# Altium schematic sheet Debugging Interface.SchDoc: Debugging Interface
size A3; DocumentNumber: 4; SheetNumber: 4; SheetTotal: 6
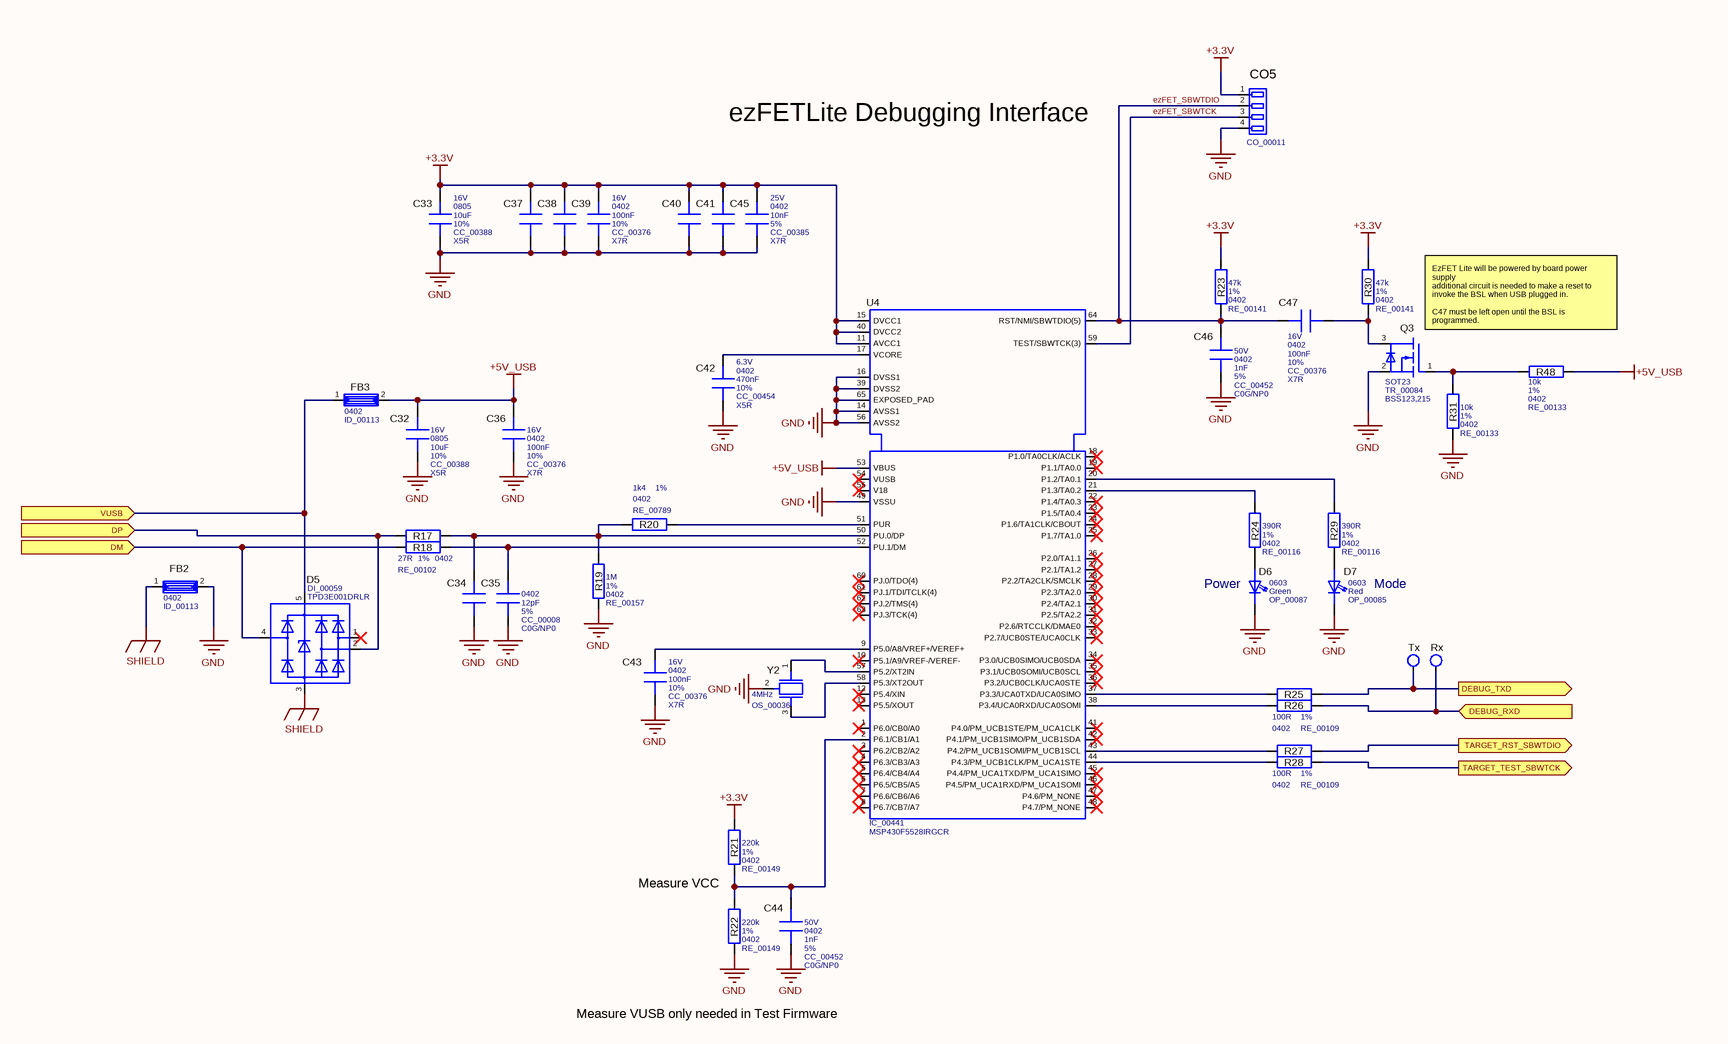
[diagram p0: Debugging Interface.SchDoc]

## Parts
C32  Voltage: 16V  Package: 0805  Capacitance: 10uF  Tolerance: 10%  Part_Number: CC_00388  Dielectric_Material: X5R  [CS2000x1250x1250x350x1650L]  (hidden comment: capacitor)
C33  Voltage: 16V  Package: 0805  Capacitance: 10uF  Tolerance: 10%  Part_Number: CC_00388  Dielectric_Material: X5R  [CS2000x1250x1250x350x1650L]  (hidden comment: capacitor)
C34  capacitor  [CS1000X500X560X250X820L]  (value not drawn)
C35  Package: 0402  Capacitance: 12pF  Tolerance: 5%  Part_Number: CC_00008  Dielectric_Material: C0G/NP0  [CS1000X500X560X250X820L]  (hidden comment: capacitor)
C36  Voltage: 16V  Package: 0402  Capacitance: 100nF  Tolerance: 10%  Part_Number: CC_00376  Dielectric_Material: X7R  [CS1000X500X560X250X820L]  (hidden comment: capacitor)
C37  capacitor  [CS1000X500X560X250X820L]  (value not drawn)
C38  capacitor  [CS1000X500X560X250X820L]  (value not drawn)
C39  Voltage: 16V  Package: 0402  Capacitance: 100nF  Tolerance: 10%  Part_Number: CC_00376  Dielectric_Material: X7R  [CS1000X500X560X250X820L]  (hidden comment: capacitor)
C40  capacitor  [CS1000X500X560X250X820L]  (value not drawn)
C41  capacitor  [CS1000X500X560X250X820L]  (value not drawn)
C42  Voltage: 6.3V  Package: 0402  Capacitance: 470nF  Tolerance: 10%  Part_Number: CC_00454  Dielectric_Material: X5R  [CS1000X500X560X250X820L]  (hidden comment: capacitor)
C43  Voltage: 16V  Package: 0402  Capacitance: 100nF  Tolerance: 10%  Part_Number: CC_00376  Dielectric_Material: X7R  [CS1000X500X560X250X820L]  (hidden comment: capacitor)
C44  Voltage: 50V  Package: 0402  Capacitance: 1nF  Tolerance: 5%  Part_Number: CC_00452  Dielectric_Material: C0G/NP0  [CS1000X500X560X250X820L]  (hidden comment: capacitor)
C45  Voltage: 25V  Package: 0402  Capacitance: 10nF  Tolerance: 5%  Part_Number: CC_00385  Dielectric_Material: X7R  [CS1000X500X560X250X820L]  (hidden comment: capacitor)
C46  Voltage: 50V  Package: 0402  Capacitance: 1nF  Tolerance: 5%  Part_Number: CC_00452  Dielectric_Material: C0G/NP0  [CS1000X500X560X250X820L]  (hidden comment: capacitor)
C47  Voltage: 16V  Package: 0402  Capacitance: 100nF  Tolerance: 10%  Part_Number: CC_00376  Dielectric_Material: X7R  [CS1000X500X560X250X820L]  (hidden comment: capacitor)
CO5  CO_00011  [CO_00011N]
D5  Manufacturer_Number: TPD3E001DRLR  [DI_00059N]  (hidden comment: DI_00059)
D6  Package: 0603  Color: Green  Part_Number: OP_00087  [OP_00087L]  (hidden comment: LED)
D7  Package: 0603  Color: Red  Part_Number: OP_00085  [OP_00085L]  (hidden comment: LED)
FB2  Package: 0402  Part_Number: ID_00113  [IS1000x500x500x200x800L]  (hidden comment: ferrit)
FB3  Package: 0402  Part_Number: ID_00113  [IS1000x500x500x200x800L]  (hidden comment: ferrit)
Q3  Package: SOT23  Part_Number: TR_00084  Manufacturer_Number: BSS123,215  [TR_00084N]  (hidden comment: nmosfet)
R17  Resistor  [RS1000X500X560X250X820L]  (value not drawn)
R18  Resistance: 27R  Tolerance: 1%  Package: 0402  Part_Number: RE_00102  [RS1000X500X560X250X820L]  (hidden comment: Resistor)
R19  Resistance: 1M  Tolerance: 1%  Package: 0402  Part_Number: RE_00157  [RS1000X500X560X250X820L]  (hidden comment: Resistor)
R20  Resistance: 1k4  Tolerance: 1%  Package: 0402  Part_Number: RE_00789  [RS1000X500X560X250X820L]  (hidden comment: Resistor)
R21  Resistance: 220k  Tolerance: 1%  Package: 0402  Part_Number: RE_00149  [RS1000X500X560X250X820L]  (hidden comment: Resistor)
R22  Resistance: 220k  Tolerance: 1%  Package: 0402  Part_Number: RE_00149  [RS1000X500X560X250X820L]  (hidden comment: Resistor)
R23  Resistance: 47k  Tolerance: 1%  Package: 0402  Part_Number: RE_00141  [RS1000X500X560X250X820L]  (hidden comment: Resistor)
R24  Resistance: 390R  Tolerance: 1%  Package: 0402  Part_Number: RE_00116  [RS1000X500X560X250X820L]  (hidden comment: Resistor)
R25  Resistor  [RS1000X500X560X250X820L]  (value not drawn)
R26  Resistance: 100R  Tolerance: 1%  Package: 0402  Part_Number: RE_00109  [RS1000X500X560X250X820L]  (hidden comment: Resistor)
R27  Resistor  [RS1000X500X560X250X820L]  (value not drawn)
R28  Resistance: 100R  Tolerance: 1%  Package: 0402  Part_Number: RE_00109  [RS1000X500X560X250X820L]  (hidden comment: Resistor)
R29  Resistance: 390R  Tolerance: 1%  Package: 0402  Part_Number: RE_00116  [RS1000X500X560X250X820L]  (hidden comment: Resistor)
R30  Resistance: 47k  Tolerance: 1%  Package: 0402  Part_Number: RE_00141  [RS1000X500X560X250X820L]  (hidden comment: Resistor)
R31  Resistance: 10k  Tolerance: 1%  Package: 0402  Part_Number: RE_00133  [RS1000X500X560X250X820L]  (hidden comment: Resistor)
R48  Resistance: 10k  Tolerance: 1%  Package: 0402  Part_Number: RE_00133  [RS1000X500X560X250X820L]  (hidden comment: Resistor)
Rx  testpoint  [CO_00057N]  (value not drawn)  (no BOM)
Tx  testpoint  [CO_00057N]  (value not drawn)  (no BOM)
U4  Manufacturer_Number: MSP430F5528IRGCR  [IC_00441N]  (hidden comment: IC_00441)
Y2  Part_Number: OS_00036  Nominal_frequency: 4MHz  [OS_00036N]  (hidden comment: ceramic_resonator)

## Ports
DEBUG_RXD (in), DEBUG_TXD (out), DM (in), DP (in), TARGET_RST_SBWTDIO (out), TARGET_TEST_SBWTCK (out), VUSB (in)

## Nets
+3.3V: C33.2(PIN2) C37.2(PIN2) C38.2(PIN2) C39.2(PIN2) C40.2(PIN2) C41.2(PIN2) C45.2(PIN2) CO5.1(PIN1) R21.2(PIN2) R23.2(PIN2) R30.2(PIN2) U4.11(AVCC1) U4.15(DVCC1) U4.40(DVCC2)
+5V_USB: C32.2(PIN2) C36.2(PIN2) FB3.2(PIN2) R48.1(PIN1) U4.53(VBUS)
GND: C32.1(PIN1) C33.1(PIN1) C34.1(PIN1) C35.1(PIN1) C36.1(PIN1) C37.1(PIN1) C38.1(PIN1) C39.1(PIN1) C40.1(PIN1) C41.1(PIN1) C42.1(PIN1) C43.1(PIN1) C44.1(PIN1) C45.1(PIN1) C46.1(PIN1) CO5.4(PIN4) D6.1(CATHODE) D7.1(CATHODE) FB2.2(PIN2) Q3.2(S) R19.1(PIN1) R22.1(PIN1) R31.1(PIN1) U4.14(AVSS1) U4.16(DVSS1) U4.39(DVSS2) U4.49(VSSU) U4.56(AVSS2) U4.65(EXPOSED_PAD) Y2.2(PIN2)
SHIELD: D5.3(GND) FB2.1(PIN1)
DEBUG_RXD: R26.2(PIN2) Rx.1(PIN1) ; port DEBUG_RXD
DEBUG_TXD: R25.2(PIN2) Tx.1(PIN1) ; port DEBUG_TXD
DM: D5.4(IO3) R18.1(PIN1) ; port DM
DP: D5.2(IO2) R17.1(PIN1) ; port DP
ezFET_SBWTCK: CO5.3(PIN3) U4.59(TEST/SBWTCK(3))
ezFET_SBWTDIO: C46.2(PIN2) C47.2(PIN2) CO5.2(PIN2) R23.1(PIN1) U4.64(RST/NMI/SBWTDIO(5))
TARGET_RST_SBWTDIO: R27.2(PIN2) ; port TARGET_RST_SBWTDIO
TARGET_TEST_SBWTCK: R28.2(PIN2) ; port TARGET_TEST_SBWTCK
VUSB: D5.5(VCC) FB3.1(PIN1) ; port VUSB
NetC34_2: C34.2(PIN2) R17.2(PIN2) R19.2(PIN2) R20.1(PIN1) U4.50(PU.0/DP)
NetC35_2: C35.2(PIN2) R18.2(PIN2) U4.52(PU.1/DM)
NetC42_2: C42.2(PIN2) U4.17(VCORE)
NetC43_2: C43.2(PIN2) U4.9(P5.0/A8/VREF+/VEREF+)
NetC44_2: C44.2(PIN2) R21.1(PIN1) R22.2(PIN2) U4.2(P6.1/CB1/A1)
NetC47_1: C47.1(PIN1) Q3.3(D) R30.1(PIN1)
NetD6_2: D6.2(ANODE) R24.1(PIN1)
NetD7_2: D7.2(ANODE) R29.1(PIN1)
NetQ3_1: Q3.1(G) R31.2(PIN2) R48.2(PIN2)
NetR20_2: R20.2(PIN2) U4.51(PUR)
NetR24_2: R24.2(PIN2) U4.21(P1.3/TA0.2)
NetR25_1: R25.1(PIN1) U4.37(P3.3/UCA0TXD/UCA0SIMO)
NetR26_1: R26.1(PIN1) U4.38(P3.4/UCA0RXD/UCA0SOMI)
NetR27_1: R27.1(PIN1) U4.43(P4.2/PM_UCB1SOMI/PM_UCB1SCL)
NetR28_1: R28.1(PIN1) U4.44(P4.3/PM_UCB1CLK/PM_UCA1STE)
NetR29_2: R29.2(PIN2) U4.20(P1.2/TA0.1)
NetU4_57: U4.57(P5.2/XT2IN) Y2.1(PIN1)
NetU4_58: U4.58(P5.3/XT2OUT) Y2.3(PIN3)

Not connected (* = marked no-connect by the designer): D5 1(IO1)*; U4 1(P6.0/CB0/A0)* 3(P6.2/CB2/A2)* 4(P6.3/CB3/A3)* 5(P6.4/CB4/A4)* 6(P6.5/CB5/A5)* 7(P6.6/CB6/A6)* 8(P6.7/CB7/A7)* 10(P5.1/A9/VREF-/VEREF-)* 12(P5.4/XIN)* 13(P5.5/XOUT)* 18(P1.0/TA0CLK/ACLK)* 19(P1.1/TA0.0)* 22(P1.4/TA0.3)* 23(P1.5/TA0.4)* 24(P1.6/TA1CLK/CBOUT)* 25(P1.7/TA1.0)* 26(P2.0/TA1.1)* 27(P2.1/TA1.2)* 28(P2.2/TA2CLK/SMCLK)* 29(P2.3/TA2.0)* 30(P2.4/TA2.1)* 31(P2.5/TA2.2)* 32(P2.6/RTCCLK/DMAE0)* 33(P2.7/UCB0STE/UCA0CLK)* 34(P3.0/UCB0SIMO/UCB0SDA)* 35(P3.1/UCB0SOMI/UCB0SCL)* 36(P3.2/UCB0CLK/UCA0STE)* 41(P4.0/PM_UCB1STE/PM_UCA1CLK)* 42(P4.1/PM_UCB1SIMO/PM_UCB1SDA)* 45(P4.4/PM_UCA1TXD/PM_UCA1SIMO)* 46(P4.5/PM_UCA1RXD/PM_UCA1SOMI)* 47(P4.6/PM_NONE)* 48(P4.7/PM_NONE)* 54(VUSB)* 55(V18)* 60(PJ.0/TDO(4))* 61(PJ.1/TDI/TCLK(4))* 62(PJ.2/TMS(4))* 63(PJ.3/TCK(4))*

## Notes on the sheet
- ezFETLite Debugging Interface
- (near Q3) EzFET Lite will be powered by board power supply
  additional circuit is needed to make a reset to
  invoke the BSL when USB plugged in.
  C47 must be left open until the BSL is programmed.
- (near D6) Power
- Mode
- Measure VCC
- Measure VUSB only needed in Test Firmware
- Size
- A3
- Rev
- Sheet
- of
- Date changed
- FH  JOANNEUM
- University of Applied Sciences
- Drawn by
- Title
- Check by

## Library data of the parts
C32 C33 = CC_00388: Part_Type: Fixed capacitors; Manufacturer_Number: GRM21BR61C106KE15L; Maximum_Capacitance: 0; Creator: Krenn Markus; Minimum_Capacitance: 0; Nominal_Voltage: 0; Creation_Date: 09.07.2012; Datasheet_Link: http://ibi/dxdb_partdatasheet_download.php?pid=388
C34 = CC_00008: Part_Type: Fixed capacitors; Manufacturer_Number: GRM1555C1H120JA01D; Voltage: 50V; Capacitance: 12pF; Tolerance: 5%; Dielectric_Material: C0G/NP0; Maximum_Capacitance: 0; Package: 0402; Creator: Krenn Markus; Part_Number: CC_00008; Minimum_Capacitance: 0; Nominal_Voltage: 0; Creation_Date: 09.07.2012; Datasheet_Link: http://ibi/dxdb_partdatasheet_download.php?pid=8
C35 = CC_00008: Part_Type: Fixed capacitors; Manufacturer_Number: GRM1555C1H120JA01D; Voltage: 50V; Maximum_Capacitance: 0; Creator: Krenn Markus; Minimum_Capacitance: 0; Nominal_Voltage: 0; Creation_Date: 09.07.2012; Datasheet_Link: http://ibi/dxdb_partdatasheet_download.php?pid=8
C36 C39 C43 C47 = CC_00376: Part_Type: Fixed capacitors; Manufacturer_Number: GRM155R71C104KA88D; Maximum_Capacitance: 0; Creator: Okorn Robert; Minimum_Capacitance: 0; Nominal_Voltage: 0; Creation_Date: 09.07.2012; Datasheet_Link: http://ibi/dxdb_partdatasheet_download.php?pid=376
C37 C38 = CC_00376: Part_Type: Fixed capacitors; Manufacturer_Number: GRM155R71C104KA88D; Voltage: 16V; Capacitance: 100nF; Tolerance: 10%; Dielectric_Material: X7R; Maximum_Capacitance: 0; Package: 0402; Creator: Okorn Robert; Part_Number: CC_00376; Minimum_Capacitance: 0; Nominal_Voltage: 0; Creation_Date: 09.07.2012; Datasheet_Link: http://ibi/dxdb_partdatasheet_download.php?pid=376
C40 C41 = CC_00385: Part_Type: Fixed capacitors; Manufacturer_Number: C0402C103J3RACTU; Voltage: 25V; Capacitance: 10nF; Tolerance: 5%; Dielectric_Material: X7R; Maximum_Capacitance: 0; Package: 0402; Creator: Neissl Gernot; Part_Number: CC_00385; Minimum_Capacitance: 0; Nominal_Voltage: 0; Creation_Date: 09.07.2012; Datasheet_Link: http://ibi/dxdb_partdatasheet_download.php?pid=385
C42 = CC_00454: Part_Type: Fixed capacitors; Manufacturer_Number: 04026D474KAT2A; Maximum_Capacitance: 0; Creator: Krenn Markus; Minimum_Capacitance: 0; Nominal_Voltage: 0; Creation_Date: 04.01.2013; Datasheet_Link: http://ibi/dxdb_partdatasheet_download.php?pid=2152
C44 C46 = CC_00452: Part_Type: Fixed capacitors; Manufacturer_Number: C1005C0G1H102J050BA; Maximum_Capacitance: 0; Creator: Krenn Markus; Minimum_Capacitance: 0; Nominal_Voltage: 0; Creation_Date: 04.01.2013; Datasheet_Link: http://ibi/dxdb_partdatasheet_download.php?pid=2150
C45 = CC_00385: Part_Type: Fixed capacitors; Manufacturer_Number: C0402C103J3RACTU; Maximum_Capacitance: 0; Creator: Neissl Gernot; Minimum_Capacitance: 0; Nominal_Voltage: 0; Creation_Date: 09.07.2012; Datasheet_Link: http://ibi/dxdb_partdatasheet_download.php?pid=385
CO5 = CO_00011: PinHeader4x1 RM2.54mm Molex; Manufacturer_Number: 90120-0124; Current: 3A; Impedance: 0R; Power: 0W; Connector_Type: Pin-Header; Function_type: Wire-to-Board; Connector_gender: male; Pitch_style: 0.00254m; Mounting_angle: 0°; Contact_Count: 4; Row_Count: 1; Contact_coating: Gold; Nominal_AC_Voltage: 350VAC; Nominal_DC_Voltage: 350VDC; Mounting: Through Hole; Material: Brass; Creator: Krenn Markus; Part_Number: CO_00011; Creation_Date: 09.07.2012; Datasheet_Link: http://ibi/dxdb_partdatasheet_download.php?pid=439
D5 = DI_00059: 3-CHANNEL ESD-PROTECTION DIODE ARRAY; Power: 0W; Diode_type: ESD Surpressor Diode; Reverse_Voltage: 5.5V; Current_DC: 0A; Diodes_per_package: 3; Forward_Voltage: 0V; Reverse-recovery_time: 0s; Package: 5SOT; Creator: Krenn Markus; Part_Number: DI_00059; Creation_Date: 09.07.2012; Datasheet_Link: http://ibi/dxdb_partdatasheet_download.php?pid=824
D6 = OP_00087: Manufacturer_Number: TLMG1100-GS08; Type: Standard; Isolating_voltage: 0; Creator: Krenn Markus; Part_Type: LED; Transistor_type: 0; Creation_Date: 23.05.2016; Datasheet_Link: http://ibi/dxdb_partdatasheet_download.php?pid=3140
D7 = OP_00085: Manufacturer_Number: TLMS1100-GS08; Type: Standard; Isolating_voltage: 0; Creator: Krenn Markus; Part_Type: LED; Transistor_type: 0; Creation_Date: 23.05.2016; Datasheet_Link: http://ibi/dxdb_partdatasheet_download.php?pid=3138
FB2 FB3 = ID_00113: Manufacturer_Number: 7427927121; Part_Type: Inductors; Inductance: 0H; Current_DC: 200mA; Creator: Kohl Martin; Creation_Date: 20.05.2014; Datasheet_Link: http://ibi/dxdb_partdatasheet_download.php?pid=2601
Q3 = TR_00084: Part_Type: MOSFET; Current: 0; Drain-Source_DC_current: 150mA; Drain-Source_Voltage: 100V; Creator: Weis Gerald; Collector-Emitter_voltage: 0; Reverse_voltage: 0; RMS_Current: 0; Creation_Date: 07.04.2016; Datasheet_Link: http://ibi/dxdb_partdatasheet_download.php?pid=3103
R17 = RE_00102: Manufacturer_Number: CRCW040227R0FKED; Part_Type: Fixed Resistors; Resistance: 27R; Tolerance: 1%; Maximum_Resistance: 0; Nominal_voltage: 50V; Package: 0402; Type: 0; Creator: Krenn Markus; Part_Number: RE_00102; Nominal_DC_Voltage: 0; Impact_current: 0; Creation_Date: 09.07.2012; Datasheet_Link: http://ibi/dxdb_partdatasheet_download.php?pid=1507
R18 = RE_00102: Manufacturer_Number: CRCW040227R0FKED; Part_Type: Fixed Resistors; Maximum_Resistance: 0; Nominal_voltage: 50V; Type: 0; Creator: Krenn Markus; Nominal_DC_Voltage: 0; Impact_current: 0; Creation_Date: 09.07.2012; Datasheet_Link: http://ibi/dxdb_partdatasheet_download.php?pid=1507
R19 = RE_00157: Manufacturer_Number: MC00625W040211M; Part_Type: Fixed Resistors; Maximum_Resistance: 0; Nominal_voltage: 50V; Type: 0; Creator: Krenn Markus; Nominal_DC_Voltage: 0; Impact_current: 0; Creation_Date: 09.07.2012; Datasheet_Link: http://ibi/dxdb_partdatasheet_download.php?pid=1562
R20 = RE_00789: Manufacturer_Number: MC00625W040211K4; Part_Type: Fixed Resistors; Maximum_Resistance: 0; Nominal_voltage: 50V; Type: 0; Nominal_DC_Voltage: 0; Impact_current: 0; Creator: Krenn Markus; Creation_Date: 05.07.2016; Datasheet_Link: http://ibi/dxdb_partdatasheet_download.php?pid=3205
R21 R22 = RE_00149: Manufacturer_Number: RC0402FR-07220KL; Part_Type: Fixed Resistors; Maximum_Resistance: 0; Nominal_voltage: 50V; Type: 0; Creator: Krenn Markus; Nominal_DC_Voltage: 0; Impact_current: 0; Creation_Date: 09.07.2012; Datasheet_Link: http://ibi/dxdb_partdatasheet_download.php?pid=1554
R23 R30 = RE_00141: Manufacturer_Number: MC00625W0402147K; Part_Type: Fixed Resistors; Maximum_Resistance: 0; Nominal_voltage: 50V; Type: 0; Creator: Krenn Markus; Nominal_DC_Voltage: 0; Impact_current: 0; Creation_Date: 09.07.2012; Datasheet_Link: http://ibi/dxdb_partdatasheet_download.php?pid=1546
R24 R29 = RE_00116: Manufacturer_Number: MC00625W04021390R; Part_Type: Fixed Resistors; Maximum_Resistance: 0; Nominal_voltage: 50V; Type: 0; Creator: Krenn Markus; Nominal_DC_Voltage: 0; Impact_current: 0; Creation_Date: 09.07.2012; Datasheet_Link: http://ibi/dxdb_partdatasheet_download.php?pid=1521
R25 R27 = RE_00109: Manufacturer_Number: RC0402FR-07100RL; Part_Type: Fixed Resistors; Resistance: 100R; Tolerance: 1%; Maximum_Resistance: 0; Nominal_voltage: 50V; Package: 0402; Type: 0; Creator: Krenn Markus; Part_Number: RE_00109; Nominal_DC_Voltage: 0; Impact_current: 0; Creation_Date: 09.07.2012; Datasheet_Link: http://ibi/dxdb_partdatasheet_download.php?pid=1514
R26 R28 = RE_00109: Manufacturer_Number: RC0402FR-07100RL; Part_Type: Fixed Resistors; Maximum_Resistance: 0; Nominal_voltage: 50V; Type: 0; Creator: Krenn Markus; Nominal_DC_Voltage: 0; Impact_current: 0; Creation_Date: 09.07.2012; Datasheet_Link: http://ibi/dxdb_partdatasheet_download.php?pid=1514
R31 R48 = RE_00133: Manufacturer_Number: MC00625W0402110K; Part_Type: Fixed Resistors; Maximum_Resistance: 0; Nominal_voltage: 50V; Type: 0; Nominal_DC_Voltage: 0; Impact_current: 0; Creator: Krenn Markus; Creation_Date: 09.07.2012; Datasheet_Link: http://ibi/dxdb_partdatasheet_download.php?pid=1538
Rx Tx = CO_00057: Testpoint 1.6mm Bohrung 1mm; Current: 0A; Impedance: 0R; Nominal_AC_Voltage: 0VAC; Nominal_DC_Voltage: 0VDC; Power: 0W; Part_Number: CO_00057; Manufacturer_Number: Testpoint; Connector_Type: Testpoint; Creator: Sirnik Heimo; Creation_Date: 09.07.2012; Datasheet_Link: http://ibi/dxdb_partdatasheet_download.php?pid=485
U4 = IC_00441: MSP430F5528IRGCR - MIXED SIGNAL MICROCONTROLLER; Part_Type: Microcontrollers/Processors; Creator: Krenn Markus; Part_Number: IC_00441; Creation_Date: 20.02.2014; Datasheet_Link: http://ibi/dxdb_partdatasheet_download.php?pid=2466
Y2 = OS_00036: Manufacturer_Number: CSTCR4M00G53-R0; Part_Type: Crystal; Tolerance: 100ppm; Creator: Krenn Markus; Creation_Date: 20.02.2014; Datasheet_Link: http://ibi/dxdb_partdatasheet_download.php?pid=2501